# Altium project PV Refridgerator.PrjPCB (part 2 of 3)

## Sheet 15VDC 500mA Boost SMPS.SchDoc: 15VDC Boost SMPS
size A4; Date: 2017-07-12; Revision: A; DesignedBy: Craig Comberbach
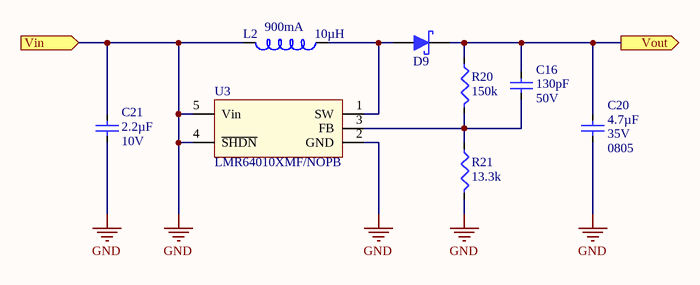
[diagram p8: 15VDC 500mA Boost SMPS.SchDoc]

### Parts
(Parts that share a designator on the sheet are numbered #1, #2 ... from top to bottom, then left to right.)
C16#1  Voltage - Rated: 50V  Capacitance: 130pF  (hidden comment: 130pF 0603 50V)
C20  Voltage - Rated: 35V  Package / Case: 0805  Capacitance: 4.7µF
C21  Capacitance: 2.2µF  Voltage - Rated: 10V  (hidden comment: 2.2uF 0603 10V)
D9  Schottky Diode 60V 3A  [SMA - Diode]  (value not drawn)
L2  Inductance: 10µH  Current - Saturation: 900mA  (hidden comment: 10uH 1210 900mA)
R20#1  Resistance (Ohms): 150k  [R0603]  (hidden comment: 150k 0603 1%)
R21  Resistance (Ohms): 13.3k  [R0603]  (hidden comment: 13.3k 0603 1%)
U3  Manufacturer Part Number: LMR64010XMF/NOPB

### Ports
Vin (in), Vout (out)

### Nets
15VDC: C16#1.2 C20.1 D9.2 R20#1.2 ; port Vout
GND: C20.2 C21.1 C21.2 L2.2 R21.1 U3.2(GND) U3.4(~{SHDN}) U3.5(Vin) ; port Vin
NetC16#1_1: C16#1.1 R20#1.1 R21.2 U3.3(FB)
NetD9_1: D9.1 L2.1 U3.1(SW)

### Notes on the sheet
- Cct
- Designed by
- Rev
- Date
- Sheet       of

### Library data of the parts
C16#1 = 130pF 0603 50V: Non-polarized; Manufacturer: Samsung Electro-Mechanics America, Inc.; Manufacturer Part Number: CL10C131JB8NNNC; Tolerance: ±5%; Temperature Coefficient: C0G, NP0; RoHS: RoHS Compliant; Category: Capacitors; Mounting Type: Surface Mount, MLCC; Operating Temperature: -55°C ~ 125°C; Applications: General Purpose; Ratings: -; Package / Case: 0603 (1608 Metric); Size / Dimension: 0.063" L x 0.031" W (1.60mm x 0.80mm); Height - Seated (Max): -; Thickness (Max): 0.035" (0.90mm); Lead Spacing: -; Features: -; Lead Style: -; ComponentLink1URL: http://media.digikey.com/pdf/Data%20Sheets/Samsung%20PDFs/CL_Series_MLCC_ds.pdf; ComponentLink1Description: Spec Sheet; Value: 130pF 0603 50V; Supplier 1: Digi-Key; Stock 1: 72882; Pricing 1: 1=0.1, 10=0.056, 100=0.0251, 500=0.0179, 1000=0.01407 (USD); Packaging: Cut Tape (CT); Supplier Part Number 1: 1276-2186-1-ND; Part Status: Active
C20 = 4.7uF 0805 35V: Non-polarized; Manufacturer: Samsung Electro-Mechanics America, Inc.; Manufacturer Part Number: CL21A475KLCLQNC; Tolerance: ±10%; Temperature Coefficient: X5R; Value: 4.7uF 0805 35V; Supplier 1: Digi-Key; Supplier Part Number 1: 1276-6722-1-ND; RoHS: RoHS Compliant; Category: Capacitors; Stock 1: 145582; Pricing 1: 1=0.17, 10=0.119, 100=0.0561, 500=0.03932, 1000=0.03255 (USD); Packaging: Cut Tape (CT); Mounting Type: Surface Mount, MLCC; Operating Temperature: -55°C ~ 85°C; Applications: General Purpose; Ratings: -; Size / Dimension: 0.079" L x 0.049" W (2.00mm x 1.25mm); Height - Seated (Max): -; Thickness (Max): 0.037" (0.95mm); Lead Spacing: -; Features: Low Profile; Lead Style: -; ComponentLink1URL: http://www.samsungsem.com/kr/support/library/product-catalog/mlcc.jsp; ComponentLink1Description: Spec Sheet; Part Status: Active
C21 = 2.2uF 0603 10V: Polarized; Manufacturer: Taiyo Yuden; Manufacturer Part Number: LMK107B7225KA-T; Tolerance: ±10%; Temperature Coefficient: X7R; Value: 2.2uF 0603 10V; ComponentLink1URL: http://media.digikey.com/pdf/Data%20Sheets/Taiyo%20Yuden%20PDFs%20URL%20links/LMK107B7225KA-T.pdf; ComponentLink1Description: Spec Sheet; Supplier 1: Digi-Key; Supplier Part Number 1: 587-2983-1-ND; RoHS: RoHS Compliant; Packaging: Cut Tape (CT); Operating Temperature: -55°C ~ 125°C; Mounting Type: Surface Mount, MLCC; Package / Case: 0603 (1608 Metric); Size / Dimension: 0.063" L x 0.031" W (1.60mm x 0.80mm); Height - Seated (Max): -; Lead Spacing: -; Features: -; Category: Capacitors; Stock 1: 348987; Pricing 1: 1=0.19, 10=0.135, 100=0.0633, 500=0.04438, 1000=0.03675 (USD); Part Status: Active; Ratings: -; Applications: General Purpose; Thickness (Max): 0.035" (0.90mm); Lead Style: -
D9 = Schottky Diode 60V 3A: Schottky Diode; Manufacturer: Diodes Incorporated; Manufacturer Part Number: B360A-13-F; Voltage - Forward (Vf) (Max) @ If: 700mV @ 3A; Speed: Fast Recovery =< 500ns, > 200mA (Io); Current - Reverse Leakage @ Vr: 500µA @ 60V; Capacitance @ Vr, F: 200pF @ 4V, 1MHz; Price P/N: 020107-024; Technology: SMT; Value: Schottky Diode 60V 3A; Supplier 1: Digi-Key; Supplier Part Number 1: B360A-FDICT-ND; RoHS: RoHS Compliant; Category: Discrete Semiconductor Products; Stock 1: 36234; Pricing 1: 1=0.63, 10=0.51, 25=0.4468, 100=0.3828, 250=0.3306, 500=0.2842, 1000=0.21609, 2500=0.19903 (CAD); Packaging: Cut Tape (CT); Diode Type: Schottky; Voltage - DC Reverse (Vr) (Max): 60V; Current - Average Rectified (Io): 3A; Reverse Recovery Time (trr): -; Mounting Type: Surface Mount; Package / Case: DO-214AC, SMA; Supplier Device Package: SMA; Operating Temperature - Junction: -55°C ~ 150°C; ComponentLink1URL: http://www.diodes.com/datasheets/ds30891.pdf; ComponentLink1Description: Spec Sheet
L2 = 10uH 1210 900mA: Inductor; Manufacturer: Taiyo Yuden; Manufacturer Part Number: CBC3225T100KR; Type: Wirewound; Material - Core: Ferrite; Tolerance: ±10%; Shielding: Unshielded; DC Resistance (DCR): 172.9 mOhm Max; Frequency - Self Resonant: 23MHz; Value: 10uH 1210 900mA; Supplier 1: Digi-Key; Supplier Part Number 1: 587-3064-1-ND; RoHS: RoHS Compliant; Stock 1: 25536; Pricing 1: 1=0.27, 10=0.237, 25=0.2076, 50=0.178, 100=0.1632, 250=0.1484, 500=0.1395 (USD); Packaging: Cut Tape (CT); Current Rating: 900mA; Q @ Freq: -; Ratings: -; Operating Temperature: -40°C ~ 105°C; Mounting Type: Surface Mount; Package / Case: 1210; Size / Dimension: 0.126" L x 0.098" W (3.20mm x 2.50mm); Height - Seated (Max): 0.106" (2.70mm); ComponentLink1URL: http://ds.yuden.co.jp/TYCOMPAS/ut/detail.do?productNo=CBC3225T100KR&fileName=CBC3225T100KR_SS&mode=specSheetDownload; ComponentLink1Description: Spec Sheet; Category: Inductors, Coils, Chokes; Part Status: Active; Supplier Device Package: 1210
R20#1 = 150k 0603 1%: Manufacturer: Yageo; Manufacturer Part Number: RC0603FR-07150KL; Power (Watts): 0.1W, 1/10W; Temperature Coefficient: ±100ppm/°C; Value: 150k 0603 1%; Supplier 1: Digi-Key; Supplier Part Number 1: 311-150KHRCT-ND; RoHS: RoHS Compliant; Category: Resistors; Stock 1: 705809; Pricing 1: 1=0.1, 10=0.015, 100=0.006, 1000=0.00268, 2500=0.00233 (USD); Packaging: Cut Tape (CT); Tolerance: ±1%; Composition: Thick Film; Features: Moisture Resistant; Package / Case: 0603 (1608 Metric); Supplier Device Package: 0603; Size / Dimension: 0.063" L x 0.031" W (1.60mm x 0.80mm); ComponentLink1URL: http://www.yageo.com/documents/recent/PYu-RC_Group_51_RoHS_L_7.pdf; ComponentLink1Description: Spec Sheet; Part Status: Active; Operating Temperature: -55°C ~ 155°C; Height - Seated (Max): 0.022" (0.55mm); Failure Rate: -
R21 = 13.3k 0603 1%: Manufacturer: Yageo; Manufacturer Part Number: RC0603FR-0713K3L; Power (Watts): 0.1W, 1/10W; Temperature Coefficient: ±100ppm/°C; Value: 13.3k 0603 1%; Supplier 1: Digi-Key; RoHS: RoHS Compliant; Category: Resistors; Stock 1: 289877; Pricing 1: 1=0.1, 10=0.015, 100=0.006, 1000=0.00268, 2500=0.00233 (USD); Packaging: Cut Tape (CT); Tolerance: ±1%; Composition: Thick Film; Features: Moisture Resistant; Operating Temperature: -55°C ~ 155°C; Package / Case: 0603 (1608 Metric); Supplier Device Package: 0603; Size / Dimension: 0.063" L x 0.031" W (1.60mm x 0.80mm); ComponentLink1URL: http://www.yageo.com/documents/recent/PYu-RC_Group_51_RoHS_L_7.pdf; ComponentLink1Description: Spec Sheet; Supplier Part Number 1: 311-13.3KHRCT-ND; Part Status: Active; Height - Seated (Max): 0.022" (0.55mm); Failure Rate: -
U3 = SMPS Boost SOT23-5 LMR64010XMF/NOPB 2.7-14Vin 3-40Vout 1A 1.6MHz: LMR64010XMFE/NOPB; Manufacturer: Texas Instruments; Function: Step-Up; Output Configuration: Positive; Topology: Boost; Output Type: Adjustable; Number of Outputs: 1; Voltage - Input (Min): 2.7V; Voltage - Input (Max): 14V; Voltage - Output (Min/Fixed): 3V; Voltage - Output (Max): 40V (Switch); Current - Output: 1A (Switch); Frequency - Switching: 1.6MHz; Synchronous Rectifier: No; Value: SMPS Boost SOT23-5 LMR64010XMF/NOPB 2.7-14Vin 3-40Vout 1A 1.6MHz; Supplier 1: Digi-Key; Supplier Part Number 1: 296-38770-1-ND; RoHS: RoHS Compliant; Stock 1: 4980; Pricing 1: 1=2.46, 10=2.212, 100=1.7778, 500=1.46062 (CAD); Packaging: Cut Tape (CT); Operating Temperature: -40°C ~ 125°C (TJ); Mounting Type: Surface Mount; Package / Case: SC-74A, SOT-753; Supplier Device Package: SOT-23-5; ComponentLink1URL: http://www.ti.com/lit/ds/symlink/lmr64010.pdf; ComponentLink1Description: Spec Sheet; Category: Integrated Circuits (ICs); Part Status: Active

## Sheet 3.3VDC 250mA Linear PS.SchDoc: 3.3V 250mA Linear Power Supply
size Letter; Date: 2017-07-12; Revision: A; DesignedBy: Craig Comberbach
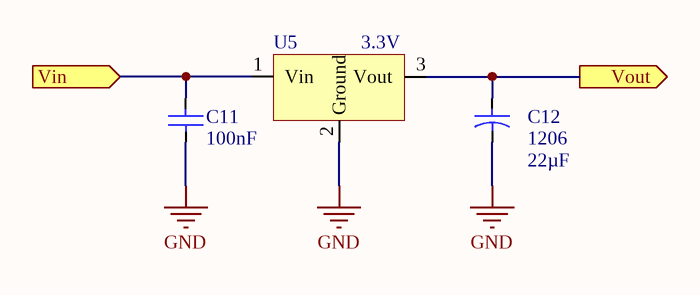
[diagram p9: 3.3VDC 250mA Linear PS.SchDoc]

### Parts
C11  Capacitance: 100nF  [Capacitor - 0603 Ceramic]  (hidden comment: 100nF 0603 50V)
C12  1206  Capacitance: 22µF  [Capacitor - 1210 Tantalum]
U5  Voltage - Output: 3.3V  [SOT223]  (hidden comment: 3.3V Linear Voltage Regulator LDO)

### Ports
Vin (in), Vout (out)

### Nets
3.3VDC: C12.1 U5.3(Vout) ; port Vout
GND: C11.1 C11.2 C12.2 U5.1(Vin) U5.2(Ground) ; port Vin

### Notes on the sheet
- PCB design/layout notes & considerations
- Design notes
- Design Capabilities
- Cct
- Designed by
- Rev
- Date
- Sheet
- of

### Library data of the parts
C11 = 100nF 0603 50V: Non-polarized; Manufacturer: Murata Electronics North America; Manufacturer Part Number: GRM188R71H104KA93D; Value: 100 nF 50V 0603 XR7 10%; Tolerance: ±10%; Temperature Coefficient: X7R; Technology: SMT; Supplier 1: Digi-Key; Supplier Part Number 1: 490-1519-1-ND; RoHS: RoHS Compliant; Category: Capacitors; Stock 1: 4132110; Pricing 1: 1=0.12, 10=0.048, 50=0.0256, 100=0.0218, 250=0.01776, 500=0.0152, 1000=0.01185 (CAD); Packaging: Cut Tape (CT); Voltage - Rated: 50V; Mounting Type: Surface Mount, MLCC; Operating Temperature: -55°C ~ 125°C; Applications: General Purpose; Ratings: -; Package / Case: 0603 (1608 Metric); Size / Dimension: 0.063" L x 0.031" W (1.60mm x 0.80mm); Height - Seated (Max): -; Thickness (Max): 0.035" (0.90mm); Lead Spacing: -; Features: -; Lead Style: -; ComponentLink1URL: http://www.murata.com/products/catalog/pdf/c02e.pdf; ComponentLink1Description: Spec Sheet
C12 = 22uF 1210 10V - Tantalum: Polarized; Manufacturer: AVX Corporation; Manufacturer Part Number: TAJB226K010RNJ; Manufacturer Size Code: B; Value: 22 uF 10V 1210 Tantalum; Tolerance: ±10%; Voltage - Rated: 10V; ESR (Equivalent Series Resistance): 2.4 Ohm; Type: Molded; Technology: SMT; Supplier 1: Digi-Key; Supplier Part Number 1: 478-3039-1-ND; RoHS: RoHS Compliant; Category: Capacitors; Stock 1: 9403; Pricing 1: 1=0.92, 10=0.882, 100=0.428, 250=0.35556, 500=0.32264, 1000=0.29629 (CAD); Packaging: Cut Tape (CT); Operating Temperature: -55°C ~ 125°C; Mounting Type: Surface Mount; Package / Case: 1210 (3528 Metric); Size / Dimension: 0.138" L x 0.110" W (3.50mm x 2.80mm); Height - Seated (Max): 0.083" (2.10mm); Lead Spacing: -; Features: General Purpose; Lifetime @ Temp.: -; ComponentLink1URL: http://www.avx.com/docs/Catalogs/taj.pdf; ComponentLink1Description: Spec Sheet
U5 = 3.3V Linear Voltage Regulator LDO: 500mA; Manufacturer: Micrel Inc; Manufacturer Part Number: MIC5209-3.3YS TR; Regulator Topology: Positive Fixed; Voltage - Dropout (Typical): 0.35V @ 500mA; Number of Regulators: 1; Voltage - Input: Up to 16V; Technology: SMT; Value: 3.3V Linear Voltage Regulator LDO; Supplier 1: Digi-Key; Supplier Part Number 1: 576-1274-1-ND; RoHS: RoHS Compliant; Category: Integrated Circuits (ICs); Stock 1: 13773; Pricing 1: 1=2.1, 10=1.871, 25=1.6516, 100=1.4864, 250=1.29364, 500=1.15602, 1000=0.9083 (CAD); Packaging: Cut Tape (CT); Current - Output: 500mA; Current - Limit (Min): -; Operating Temperature: -40°C ~ 125°C; Mounting Type: Surface Mount; Package / Case: TO-261-4, TO-261AA; Supplier Device Package: SOT-223; ComponentLink1URL: http://www.micrel.com/_PDF/mic5209.pdf; ComponentLink1Description: Spec Sheet

## Sheet 5VDC 250mA Buck SMPS.SchDoc: 5VDC 250mA Switching Regulator
size A4; Date: 2017-07-12; DocumentNumber: 3; Revision: A; SheetNumber: 3; SheetTotal: 12; DesignedBy: Craig Comberbach
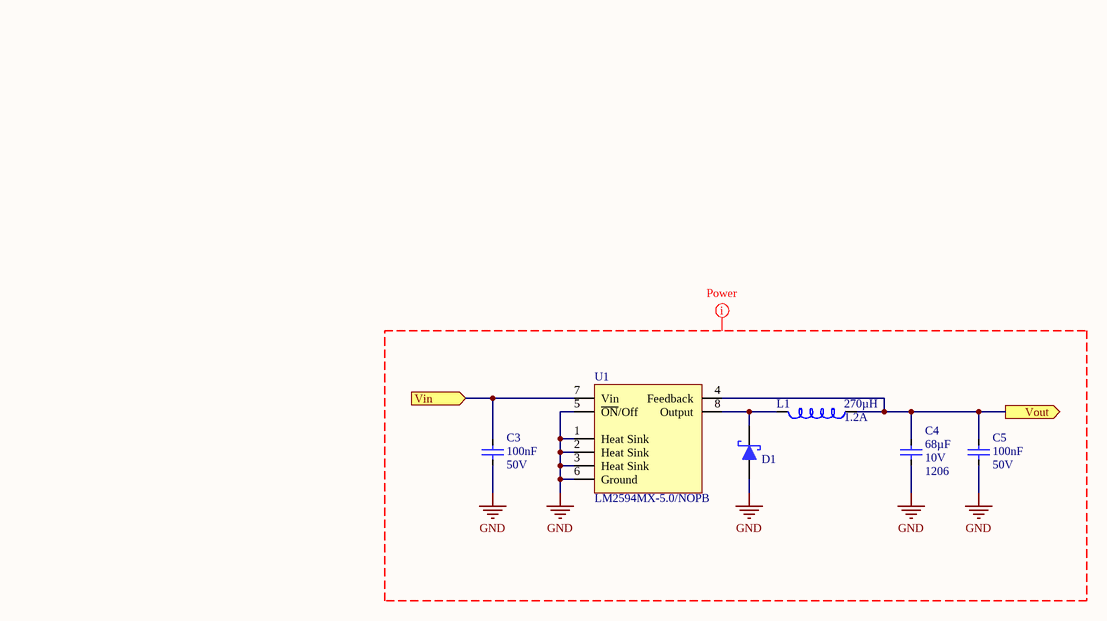
[diagram p10: 5VDC 250mA Buck SMPS.SchDoc]

### Parts
(Parts that share a designator on the sheet are numbered #1, #2 ... from top to bottom, then left to right.)
C3  Voltage - Rated: 50V  Capacitance: 100nF  [Capacitor - 0603 Ceramic]  (hidden comment: 100nF 0603 50V)
C4#1  Voltage - Rated: 10V  Package / Case: 1206  Capacitance: 68µF  (hidden comment: 68uF 1206 10V)
C5#1  Voltage - Rated: 50V  Capacitance: 100nF  [Capacitor - 0603 Ceramic]  (hidden comment: 100nF 0603 50V)
D1#2  Schottky Diode 60V 3A  [SMA - Diode]  (value not drawn)
L1  Inductance: 270µH  Current - Saturation: 1.2A  (hidden comment: 270uH SRR1260 1.2A)
U1#1  Manufacturer Part Number: LM2594MX-5.0/NOPB  (hidden comment: 5VDC 250mA SMPS)

### Ports
Vin (in), Vout (out)

### Nets
GND: C3.2 C4#1.1 C4#1.2 C5#1.1 C5#1.2 D1#2.1 L1.1 U1#1.1(Heat_Sink) U1#1.2(Heat_Sink) U1#1.3(Heat_Sink) U1#1.4(Feedback) U1#1.5(~{ON}/Off) U1#1.6(Ground) ; port Vout
+Vsolar: C3.1 U1#1.7(Vin) ; port Vin
NetD1#2_2: D1#2.2 L1.2 U1#1.8(Output)

### Layout directives
net class Power: GND

### Notes on the sheet
- Change Log:
  Rev A	2014-11-19	Craig Comberbach
  Initial Design
  Rev B	2017-01-27	Craig Comberbach
  Added inline nettie for current sensing
  Removed 5.5V MOV from the output
  Added current sensing test clips as well as a ground test clip
- Cct
- Designed by
- Rev
- Date
- Sheet       of

### Library data of the parts
C3 C5#1 = 100nF 0603 50V: as C11 on sheet 3.3VDC 250mA Linear PS; Price P/N: 020101-017; Technology: SMT; Supplier 1: Digi-Key; Supplier Part Number 1: 490-1519-1-ND; RoHS: RoHS Compliant; Category: Capacitors; Stock 1: 4132110; Pricing 1: 1=0.12, 10=0.048, 50=0.0256, 100=0.0218, 250=0.01776, 500=0.0152, 1000=0.01185 (CAD); Packaging: Cut Tape (CT); Mounting Type: Surface Mount, MLCC; Operating Temperature: -55°C ~ 125°C; Applications: General Purpose; Ratings: -; Package / Case: 0603 (1608 Metric); Size / Dimension: 0.063" L x 0.031" W (1.60mm x 0.80mm); Height - Seated (Max): -; Thickness (Max): 0.035" (0.90mm); Lead Spacing: -; Features: -; Lead Style: -; ComponentLink1URL: http://www.murata.com/products/catalog/pdf/c02e.pdf; ComponentLink1Description: Spec Sheet
C4#1 = 68uF 1206 10V: Non-polarized; Manufacturer: TDK Corporation; Manufacturer Part Number: C3216X5R1A686M160AC; Tolerance: ±20%; Temperature Coefficient: X5R; Value: 68uF 1206 10V; Supplier 1: Digi-Key; Supplier Part Number 1: 445-14673-1-ND; RoHS: RoHS Compliant; Category: Capacitors; Stock 1: 17695; Pricing 1: 1=1.59, 10=1.252, 100=0.9393, 500=0.70966, 1000=0.62618 (USD); Packaging: Cut Tape (CT); Operating Temperature: -55°C ~ 85°C; Mounting Type: Surface Mount, MLCC; Size / Dimension: 0.126" L x 0.063" W (3.20mm x 1.60mm); Height - Seated (Max): -; Lead Spacing: -; Features: Low ESL; ComponentLink1URL: https://product.tdk.com/info/en/catalog/datasheets/mlcc_commercial_general_en.pdf; ComponentLink1Description: Spec Sheet; Part Status: Active; Ratings: -; Applications: General Purpose; Failure Rate: -; Thickness (Max): 0.071" (1.80mm); Lead Style: -
D1#2 = Schottky Diode 60V 3A: as D9 on sheet 15VDC 500mA Boost SMPS; Price P/N: 020107-024; Technology: SMT; Value: Schottky Diode 60V 3A; Supplier 1: Digi-Key; Supplier Part Number 1: B360A-FDICT-ND; RoHS: RoHS Compliant; Category: Discrete Semiconductor Products; Stock 1: 36234; Pricing 1: 1=0.63, 10=0.51, 25=0.4468, 100=0.3828, 250=0.3306, 500=0.2842, 1000=0.21609, 2500=0.19903 (CAD); Packaging: Cut Tape (CT); Diode Type: Schottky; Voltage - DC Reverse (Vr) (Max): 60V; Current - Average Rectified (Io): 3A; Reverse Recovery Time (trr): -; Mounting Type: Surface Mount; Package / Case: DO-214AC, SMA; Supplier Device Package: SMA; Operating Temperature - Junction: -55°C ~ 150°C; ComponentLink1URL: http://www.diodes.com/datasheets/ds30891.pdf; ComponentLink1Description: Spec Sheet
L1 = 270uH SRR1260 1.2A: Inductor; Manufacturer: Bourns Inc.; Manufacturer Part Number: SRR1260-271K; Shielding: Shielded; Tolerance: ±10%; Type: Wirewound; Material - Core: Ferrite; Current Rating: 1.3A; DC Resistance (DCR): 450 mOhm Max; Q @ Freq: 20 @ 796kHz; Frequency - Self Resonant: 3.6MHz; Value: 270uH SRR1260 1.2A; Supplier 1: Digi-Key; Supplier Part Number 1: SRR1260-271KCT-ND; RoHS: RoHS Compliant; Category: Inductors, Coils, Chokes; Stock 1: 13499; Packaging: Cut Tape (CT); ComponentLink1URL: http://www.bourns.com/docs/Product-Datasheets/SRR1260.pdf; ComponentLink1Description: Spec Sheet; Pricing 1: 1=1, 10=0.927, 100=0.6702 (USD); Part Status: Active; Ratings: -; Operating Temperature: -40°C ~ 125°C; Mounting Type: Surface Mount; Package / Case: Nonstandard; Supplier Device Package: -; Size / Dimension: 0.492" L x 0.492" W (12.50mm x 12.50mm); Height - Seated (Max): 0.256" (6.50mm)
U1#1 = 5VDC 250mA SMPS: Manufacturer: Texas Instruments; Output Type: Fixed; Number of Outputs: 1; Frequency - Switching: 150kHz; Current - Output: 500mA; Synchronous Rectifier: No; Function: Step-Down; Output Configuration: Positive; Topology: Buck; Voltage - Input (Min): 4.5V; Voltage - Input (Max): 40V; Voltage - Output (Min/Fixed): 5V; Supplier 1: Digi-Key; Supplier Part Number 1: LM2594MX-5.0/NOPBCT-ND; RoHS: RoHS Compliant; Category: Integrated Circuits (ICs); Stock 1: 3233; Pricing 1: 1=3.28, 10=2.942, 100=2.4102, 500=2.05176, 1000=1.7304 (USD); Packaging: Cut Tape (CT); Operating Temperature: -40°C ~ 125°C (TJ); Mounting Type: Surface Mount; Package / Case: 8-SOIC (0.154", 3.90mm Width); Supplier Device Package: 8-SOIC; ComponentLink1URL: http://www.ti.com/lit/ds/symlink/lm2594.pdf; ComponentLink1Description: Spec Sheet; Value: 5VDC 250mA SMPS; Part Status: Active; Voltage - Output (Max): -

## Sheet Microcontroller.SchDoc: Microcontroller
size Letter; Date: 2017-07-12; DocumentNumber: 10; Revision: B; SheetNumber: 10; SheetTotal: 16; DesignedBy: Craig Comberbach
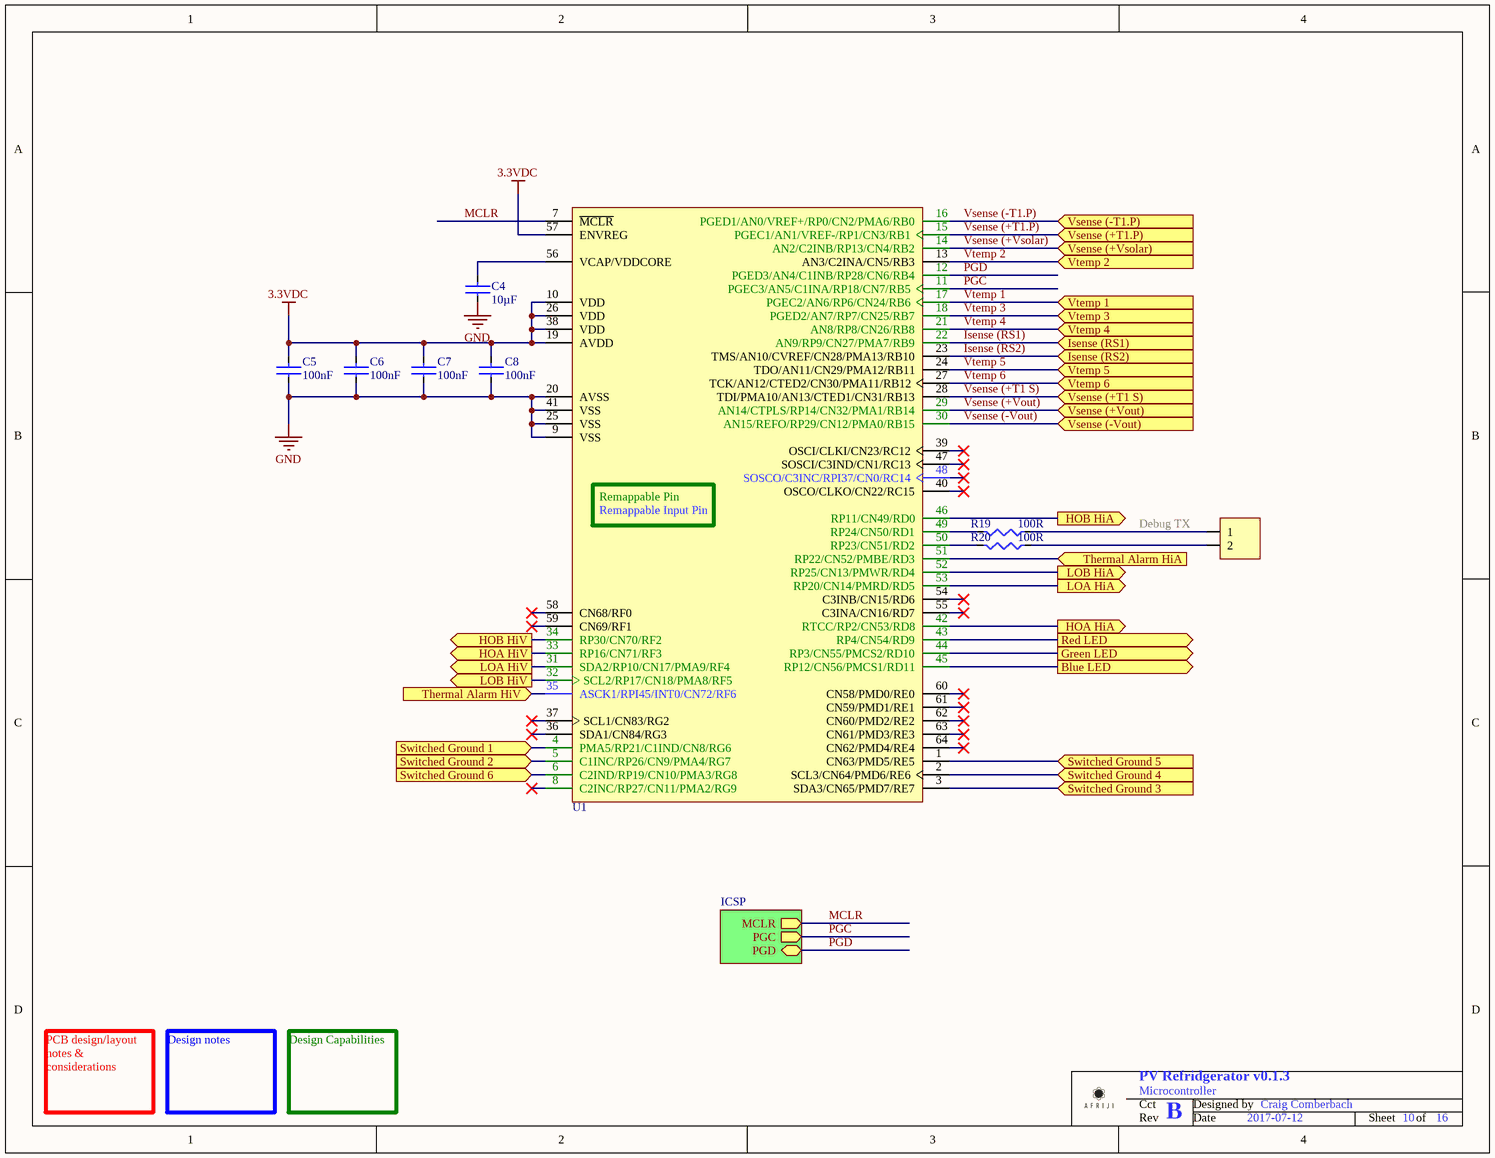
[diagram p11: Microcontroller.SchDoc]

### Parts
(Parts that share a designator on the sheet are numbered #1, #2 ... from top to bottom, then left to right.)
C4#2  Capacitance: 10µF  [C0805 - Ceramic]  (hidden comment: 10uF 0805 10V)
C5#2  Capacitance: 100nF  [C0603 - Ceramic]  (hidden comment: 100nF 0603 50V)
C6  Capacitance: 100nF  [C0603 - Ceramic]  (hidden comment: 100nF 0603 50V)
C7  Capacitance: 100nF  [C0603 - Ceramic]  (hidden comment: 100nF 0603 50V)
C8  Capacitance: 100nF  [C0603 - Ceramic]  (hidden comment: 100nF 0603 50V)
R19  Resistance (Ohms): 100R  [R0603]  (hidden comment: 100R 0603 1%)
R20#2  Resistance (Ohms): 100R  [R0603]  (hidden comment: 100R 0603 1%)
TP3  MTA100-2 with friction Lock  (value not drawn)
U1#2  PIC24FJ256GA106 Microprocessor  [TQFP - 64]  (value not drawn)

### Sub-sheets
ICSP = ICSP.SchDoc: MCLR (out), PGD (bidir), PGC (out)

### Ports
Blue LED (out), Green LED (out), HOA HiA (out), HOA HiV (out), HOB HiA (out), HOB HiV (out), Isense (RS1) (in), Isense (RS2) (in), LOA HiA (out), LOA HiV (out), LOB HiA (out), LOB HiV (out), Red LED (out), Switched Ground 1 (in), Switched Ground 2 (in), Switched Ground 3 (in), Switched Ground 4 (in), Switched Ground 5 (in), Switched Ground 6 (in), Thermal Alarm HiA (in), Thermal Alarm HiV (in), Vsense (+T1 S) (in), Vsense (+T1.P) (in), Vsense (+Vout) (in), Vsense (+Vsolar) (in), Vsense (-T1.P) (in), Vsense (-Vout) (in), Vtemp 1 (in), Vtemp 2 (in), Vtemp 3 (in), Vtemp 4 (in), Vtemp 5 (in), Vtemp 6 (in)

### Nets
3.3VDC: C5#2.1 C6.1 C7.1 C8.1 U1#2.10(VDD) U1#2.19(AVDD) U1#2.26(VDD) U1#2.38(VDD) U1#2.57(ENVREG)
GND: C4#2.2 C5#2.2 C6.2 C7.2 C8.2 U1#2.9(VSS) U1#2.20(AVSS) U1#2.25(VSS) U1#2.41(VSS)
Debug TX: R19.2 TP3.1
Isense (RS1): U1#2.22(AN9/RP9/CN27/PMA7/RB9) ; port Isense (RS1)
Isense (RS2): U1#2.23(TMS/AN10/CVREF/CN28/PMA13/RB10) ; port Isense (RS2)
MCLR: U1#2.7(~{MCLR}) ; sheet ICSP/MCLR
PGC: U1#2.11(PGEC3/AN5/C1INA/RP18/CN7/RB5) ; sheet ICSP/PGC
PGD: U1#2.12(PGED3/AN4/C1INB/RP28/CN6/RB4) ; sheet ICSP/PGD
Switched Ground 1: U1#2.4(PMA5/RP21/C1IND/CN8/RG6) ; port Switched Ground 1
Switched Ground 2: U1#2.5(C1INC/RP26/CN9/PMA4/RG7) ; port Switched Ground 2
Switched Ground 3: U1#2.3(SDA3/CN65/PMD7/RE7) ; port Switched Ground 3
Switched Ground 4: U1#2.2(SCL3/CN64/PMD6/RE6) ; port Switched Ground 4
Switched Ground 5: U1#2.1(CN63/PMD5/RE5) ; port Switched Ground 5
Switched Ground 6: U1#2.6(C2IND/RP19/CN10/PMA3/RG8) ; port Switched Ground 6
Vsense (+T1 S): U1#2.28(TDI/PMA10/AN13/CTED1/CN31/RB13) ; port Vsense (+T1 S)
Vsense (+T1.P): U1#2.15(PGEC1/AN1/VREF-/RP1/CN3/RB1) ; port Vsense (+T1.P)
Vsense (+Vout): U1#2.29(AN14/CTPLS/RP14/CN32/PMA1/RB14) ; port Vsense (+Vout)
Vsense (+Vsolar): U1#2.14(AN2/C2INB/RP13/CN4/RB2) ; port Vsense (+Vsolar)
Vsense (-T1.P): U1#2.16(PGED1/AN0/VREF+/RP0/CN2/PMA6/RB0) ; port Vsense (-T1.P)
Vsense (-Vout): U1#2.30(AN15/REFO/RP29/CN12/PMA0/RB15) ; port Vsense (-Vout)
Vtemp 1: U1#2.17(PGEC2/AN6/RP6/CN24/RB6) ; port Vtemp 1
Vtemp 2: U1#2.13(AN3/C2INA/CN5/RB3) ; port Vtemp 2
Vtemp 3: U1#2.18(PGED2/AN7/RP7/CN25/RB7) ; port Vtemp 3
Vtemp 4: U1#2.21(AN8/RP8/CN26/RB8) ; port Vtemp 4
Vtemp 5: U1#2.24(TDO/AN11/CN29/PMA12/RB11) ; port Vtemp 5
Vtemp 6: U1#2.27(TCK/AN12/CTED2/CN30/PMA11/RB12) ; port Vtemp 6
NetC4#2_1: C4#2.1 U1#2.56(VCAP/VDDCORE)
NetR19_1: R19.1 U1#2.49(RP24/CN50/RD1)
NetR20#2_1: R20#2.1 U1#2.50(RP23/CN51/RD2)
NetR20#2_2: R20#2.2 TP3.2
NetU1#2_31: U1#2.31(SDA2/RP10/CN17/PMA9/RF4) ; port LOA HiV
NetU1#2_32: U1#2.32(SCL2/RP17/CN18/PMA8/RF5) ; port LOB HiV
NetU1#2_33: U1#2.33(RP16/CN71/RF3) ; port HOA HiV
NetU1#2_34: U1#2.34(RP30/CN70/RF2) ; port HOB HiV
NetU1#2_35: U1#2.35(ASCK1/RPI45/INT0/CN72/RF6) ; port Thermal Alarm HiV
NetU1#2_42: U1#2.42(RTCC/RP2/CN53/RD8) ; port HOA HiA
NetU1#2_43: U1#2.43(RP4/CN54/RD9) ; port Red LED
NetU1#2_44: U1#2.44(RP3/CN55/PMCS2/RD10) ; port Green LED
NetU1#2_45: U1#2.45(RP12/CN56/PMCS1/RD11) ; port Blue LED
NetU1#2_46: U1#2.46(RP11/CN49/RD0) ; port HOB HiA
NetU1#2_51: U1#2.51(RP22/CN52/PMBE/RD3) ; port Thermal Alarm HiA
NetU1#2_52: U1#2.52(RP25/CN13/PMWR/RD4) ; port LOB HiA
NetU1#2_53: U1#2.53(RP20/CN14/PMRD/RD5) ; port LOA HiA

Not connected (* = marked no-connect by the designer): U1#2 8(C2INC/RP27/CN11/PMA2/RG9)* 36(SDA1/CN84/RG3)* 37(SCL1/CN83/RG2)* 39(OSCI/CLKI/CN23/RC12)* 40(OSCO/CLKO/CN22/RC15)* 47(SOSCI/C3IND/CN1/RC13)* 48(SOSCO/C3INC/RPI37/CN0/RC14)* 54(C3INB/CN15/RD6)* 55(C3INA/CN16/RD7)* 58(CN68/RF0)* 59(CN69/RF1)* 60(CN58/PMD0/RE0)* 61(CN59/PMD1/RE1)* 62(CN60/PMD2/RE2)* 63(CN61/PMD3/RE3)* 64(CN62/PMD4/RE4)*

### Notes on the sheet
- PCB design/layout notes & considerations
- Design notes
- Design Capabilities
- Cct
- Designed by
- Rev
- Date
- Sheet
- of
- (in symbol PIC24FJ256GA106 Microprocessor) Remappable Pin; Remappable Input Pin

### Library data of the parts
C4#2 = 10uF 0805 10V: Manufacturer: Kemet; Manufacturer Part Number: C0805C106K8PACTU; Tolerance: ±10%; Temperature Coefficient: X5R; Value: 10uF 0805 10V; Supplier 1: Digi-Key; RoHS: RoHS Compliant; Category: Capacitors; Stock 1: 215894; Pricing 1: 1=0.21, 10=0.14, 50=0.085, 100=0.0714, 250=0.0578, 500=0.051, 1000=0.04335 (USD); Packaging: Cut Tape (CT); Voltage - Rated: 10V; Mounting Type: Surface Mount, MLCC; Operating Temperature: -55°C ~ 85°C; Applications: General Purpose; Ratings: -; Package / Case: 0805 (2012 Metric); Size / Dimension: 0.079" L x 0.049" W (2.00mm x 1.25mm); Height - Seated (Max): -; Thickness (Max): 0.055" (1.40mm); Lead Spacing: -; Features: -; Lead Style: -; ComponentLink1URL: http://www.kemet.com/docfinder?Partnumber=C0805C106K8PACTU; ComponentLink1Description: Spec Sheet; Supplier Part Number 1: 399-4925-1-ND
C5#2 C6-C8 = 100nF 0603 50V: Manufacturer: Samsung Electro-Mechanics America, Inc; Manufacturer Part Number: CL10B104KB8SFNC; Tolerance: ±10%; Temperature Coefficient: X7R; Value: 100nF 0603 50V; Supplier 1: Digi-Key; RoHS: RoHS Compliant; Category: Capacitors; Stock 1: 1192070; Pricing 1: 1=0.1, 10=0.027, 25=0.0192, 100=0.0125, 500=0.00874, 1000=0.00681 (USD); Packaging: Cut Tape (CT); Voltage - Rated: 50V; Mounting Type: Surface Mount, MLCC; Operating Temperature: -55°C ~ 125°C; Applications: Boardflex Sensitive; Ratings: -; Package / Case: 0603 (1608 Metric); Size / Dimension: 0.063" L x 0.031" W (1.60mm x 0.80mm); Height - Seated (Max): -; Thickness (Max): 0.035" (0.90mm); Lead Spacing: -; Features: Soft Termination; Lead Style: -; ComponentLink1URL: http://www.samsungsem.com/kr/front/downloadcms.do?path=/kr/support/product-search/mlcc/__icsFiles/afieldfile/2014/11/05&fileName=S_CL10B104KB8SFNC.pdf; ComponentLink1Description: Spec Sheet; Supplier Part Number 1: 1276-1936-1-ND
R19 R20#2 = 100R 0603 1%: 1/8W; Manufacturer: Yageo; Manufacturer Part Number: RC0603FR-07100RL; Power (Watts): 0.1W, 1/10W; Temperature Coefficient: ±100ppm/°C; Value: 100R 0603 1%; Supplier 1: Digi-Key; RoHS: RoHS Compliant; Category: Resistors; Stock 1: 2116183; Pricing 1: 1=0.1, 10=0.015, 25=0.0108, 100=0.006, 250=0.00456, 500=0.00364, 1000=0.00268, 2500=0.00233 (USD); Packaging: Cut Tape (CT); Tolerance: ±1%; Composition: Thick Film; Features: Moisture Resistant; Operating Temperature: -55°C ~ 155°C; Package / Case: 0603 (1608 Metric); Supplier Device Package: 0603; Size / Dimension: 0.063" L x 0.031" W (1.60mm x 0.80mm); Height: 0.022" (0.55mm); Number of Terminations: 2; ComponentLink1URL: http://www.yageo.com/NewPortal/yageodocoutput?fileName=/pdf/R-Chip/PYu-RC_Group_51_RoHS_L_0.pdf; ComponentLink1Description: http://www.yageo.com/NewPortal/yageodocoutput?fileName=/pdf/R-Chip/PYu-RC_Group_51_RoHS_L_0.pdf; Supplier Part Number 1: 311-100HRCT-ND
TP3 = MTA100-2 with friction Lock: Manufacturer: TE Connectivity AMP Connectors; Manufacturer Part Number: 640456-2; Connector Type: Header; Pitch - Mating: 0.100" (2.54mm); Style: Board to Cable/Wire; Shrouding: Shrouded - 1 Wall; Number of Positions: 2; Number of Positions Loaded: All; Contact Length - Mating: 0.295" (7.49mm); Contact Length - Post: 0.140" (3.56mm); Overall Contact Length: 0.535" (13.59mm); Material Flammability Rating: UL94 V-0; Current Rating: Varies by Wire Gauge; Voltage Rating: 250VAC; Value: MTA100-2 with friction Lock; Supplier 1: Digi-Key; RoHS: RoHS Compliant; Category: Connectors, Interconnects; Stock 1: 177276; Pricing 1: 1=0.12, 10=0.117, 50=0.0748, 100=0.0724, 250=0.0624, 500=0.05992, 1000=0.05243, 2500=0.04744 (USD); Packaging: Bulk; Part Status: Active; Mounting Type: Through Hole; ComponentLink1URL: http://www.te.com/commerce/DocumentDelivery/DDEController?Action=srchrtrv&DocNm=640456&DocType=Customer+Drawing&DocLang=English; ComponentLink1Description: Spec Sheet; Supplier Part Number 1: A1921-ND; Contact Type: Male Pin; Number of Rows: 1; Row Spacing - Mating: -; Termination: Solder; Fastening Type: Friction Lock; Insulation Height: 0.305" (7.75mm); Contact Shape: Square; Contact Finish - Mating: Tin; Contact Finish Thickness - Mating: -; Contact Finish - Post: Tin; Contact Material: Copper Alloy; Insulation Material: Thermoplastic; Features: -; Operating Temperature: -55°C ~ 105°C; Ingress Protection: -; Insulation Color: Natural; Mated Stacking Heights: -; Contact Finish Thickness - Post: -; Applications: General Purpose
U1#2 = PIC24FJ256GA106 Microprocessor: General Purpose 16-Bit Flash Microcontroller, 256KB Flash, 16KB SRAM, 64-Pin TQFP, Industrial Temperature; Manufacturer: Microchip Technology; Manufacturer Part Number: PIC24FJ256GA106-I/PT; Core Processor: PIC; Speed: 32MHz; Connectivity: I²C, PMP, SPI, UART/USART; Peripherals: Brown-out Detect/Reset, LVD, POR, PWM, WDT; Number of I/O: 53; Program Memory Size: 256KB (85.5K x 24); RAM Size: 16K x 8; Voltage - Supply (Vcc/Vdd): 2 V ~ 3.6 V; Data Converters: A/D 16x10b; Oscillator Type: Internal; Value: PIC24FJ256GA106 Microprocessor; Technology: SMT; Supplier 1: Digi-Key; Supplier Part Number 1: PIC24FJ256GA106-I/PT-ND; RoHS: RoHS Compliant; Category: Integrated Circuits (ICs); Stock 1: 6379; Pricing 1: 1=7.45, 10=6.201, 25=5.6864, 100=5.1477 (CAD); Packaging: Tray; Core Size: 16-Bit; Program Memory Type: FLASH; EEPROM Size: -; Operating Temperature: -40°C ~ 85°C; Package / Case: 64-TQFP; Supplier Device Package: 64-TQFP (10x10); ComponentLink1URL: http://www.microchip.com/mymicrochip/filehandler.aspx?ddocname=en534317; ComponentLink1Description: Spec Sheet

## Sheet ICSP.SchDoc: ICSP
size Letter; Date: 2017-02-06; DocumentNumber: 11; Revision: B; SheetNumber: 11; SheetTotal: 16; DesignedBy: Craig Comberbach
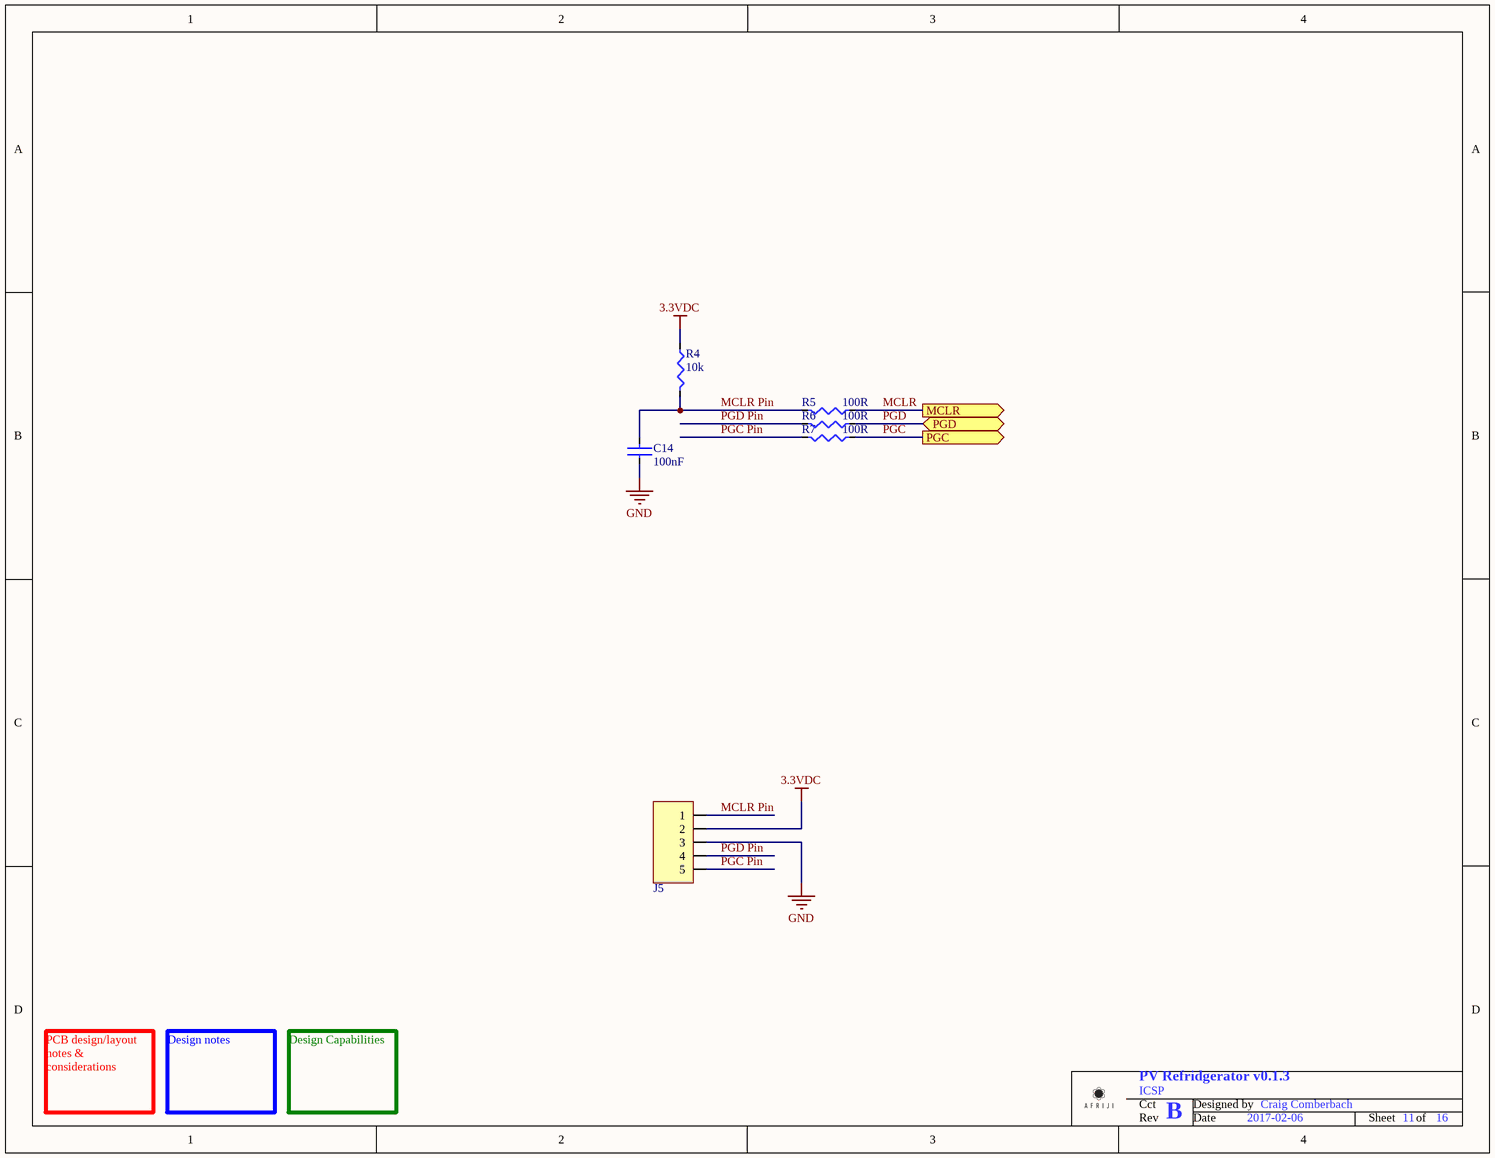
[diagram p12: ICSP.SchDoc]

### Parts
C14  Capacitance: 100nF  [C0603 - Ceramic]  (hidden comment: 100nF 0603 50V)
J5  MTA100 - 5-Pin with friction Lock  [Connector - MTA-100 5 Position]  (value not drawn)
R4  Resistance (Ohms): 10k  [R0603]  (hidden comment: 10k 0603 1%)
R5  Resistance (Ohms): 100R  [R0603]  (hidden comment: 100R 0603 1%)
R6  Resistance (Ohms): 100R  [R0603]  (hidden comment: 100R 0603 1%)
R7  Resistance (Ohms): 100R  [R0603]  (hidden comment: 100R 0603 1%)

### Ports
MCLR (out), PGC (out), PGD (bidir)

### Nets
3.3VDC: J5.2 R4.1
GND: C14.2 J5.3
MCLR: R5.2 ; port MCLR
MCLR Pin: C14.1 J5.1 R4.2 R5.1
PGC: R7.2 ; port PGC
PGC Pin: J5.5 R7.1
PGD: R6.2 ; port PGD
PGD Pin: J5.4 R6.1

### Notes on the sheet
- PCB design/layout notes & considerations
- Design notes
- Design Capabilities
- Cct
- Designed by
- Rev
- Date
- Sheet
- of

### Library data of the parts
C14 = 100nF 0603 50V: as C5#2 on sheet Microcontroller; Value: 100nF 0603 50V; Supplier 1: Digi-Key; RoHS: RoHS Compliant; Category: Capacitors; Stock 1: 1192070; Pricing 1: 1=0.1, 10=0.027, 25=0.0192, 100=0.0125, 500=0.00874, 1000=0.00681 (USD); Packaging: Cut Tape (CT); Voltage - Rated: 50V; Mounting Type: Surface Mount, MLCC; Operating Temperature: -55°C ~ 125°C; Applications: Boardflex Sensitive; Ratings: -; Package / Case: 0603 (1608 Metric); Size / Dimension: 0.063" L x 0.031" W (1.60mm x 0.80mm); Height - Seated (Max): -; Thickness (Max): 0.035" (0.90mm); Lead Spacing: -; Features: Soft Termination; Lead Style: -; ComponentLink1URL: http://www.samsungsem.com/kr/front/downloadcms.do?path=/kr/support/product-search/mlcc/__icsFiles/afieldfile/2014/11/05&fileName=S_CL10B104KB8SFNC.pdf; ComponentLink1Description: http://www.samsungsem.com/kr/front/downloadcms.do?path=/kr/support/product-search/mlcc/__icsFiles/afieldfile/2014/11/05&fileName=S_CL10B104KB8SFNC.pdf; Supplier Part Number 1: 1276-1936-1-ND
J5 = MTA100 - 5-Pin with friction Lock: Flash Programmer; Manufacturer: TE Connectivity; Manufacturer Part Number: 640456-5; Connector Type: Header, Unshrouded; Number of Positions: 5; Number of Positions Loaded: All; Pitch: 0.100" (2.54mm); Supplier 1: Digi-Key; Supplier Part Number 1: A19471-ND; RoHS: RoHS Compliant; Category: Connectors, Interconnects; Stock 1: 38829; Pricing 1: 1=0.34, 10=0.314, 50=0.2286, 100=0.2197, 250=0.1972, 500=0.18824, 1000=0.15687, 2500=0.14343, 5000=0.13446 (CAD); Packaging: Bulk; Contact Type: Male Pin; Number of Rows: 1; Row Spacing: -; Contact Mating Length: 0.295" (7.49mm); Mounting Type: Through Hole; Termination: Solder; Fastening Type: Friction Lock; Features: -; Contact Finish: Tin; Contact Finish Thickness: -; Color: Natural; ComponentLink1URL: http://www.te.com/commerce/DocumentDelivery/DDEController?Action=srchrtrv&DocNm=640456&DocType=Customer+Drawing&DocLang=English; ComponentLink1Description: Spec Sheet; Technology: THT; Value: MTA100 - 5-Pin with friction Lock
R4 = 10k 0603 1%: Resistor; Manufacturer: Yageo; Manufacturer Part Number: RC0603FR-0710KL; Power (Watts): 0.1W, 1/10W; Temperature Coefficient: ±100ppm/°C; Value: 10k 0603 1%; Supplier 1: Digi-Key; RoHS: RoHS Compliant; Category: Resistors; Stock 1: 5171799; Pricing 1: 1=0.1, 10=0.015, 25=0.0108, 100=0.006, 250=0.00456, 500=0.00364, 1000=0.00268, 2500=0.00233 (USD); Packaging: Cut Tape (CT); Tolerance: ±1%; Composition: Thick Film; Features: Moisture Resistant; Package / Case: 0603 (1608 Metric); Supplier Device Package: 0603; Size / Dimension: 0.063" L x 0.031" W (1.60mm x 0.80mm); Height: 0.022" (0.55mm); Number of Terminations: 2; ComponentLink1URL: http://www.yageo.com/NewPortal/yageodocoutput?fileName=/pdf/R-Chip/PYu-RC_Group_51_RoHS_L_0.pdf; ComponentLink1Description: http://www.yageo.com/NewPortal/yageodocoutput?fileName=/pdf/R-Chip/PYu-RC_Group_51_RoHS_L_0.pdf; Supplier Part Number 1: 311-10.0KHRCT-ND; Operating Temperature: -55°C ~ 155°C
R5-R7 = 100R 0603 1%: as R19 on sheet Microcontroller; Value: 100R 0603 1%; Supplier 1: Digi-Key; RoHS: RoHS Compliant; Category: Resistors; Stock 1: 2116183; Pricing 1: 1=0.1, 10=0.015, 25=0.0108, 100=0.006, 250=0.00456, 500=0.00364, 1000=0.00268, 2500=0.00233 (USD); Packaging: Cut Tape (CT); Tolerance: ±1%; Composition: Thick Film; Features: Moisture Resistant; Package / Case: 0603 (1608 Metric); Supplier Device Package: 0603; Size / Dimension: 0.063" L x 0.031" W (1.60mm x 0.80mm); Height: 0.022" (0.55mm); Number of Terminations: 2; ComponentLink1URL: http://www.yageo.com/NewPortal/yageodocoutput?fileName=/pdf/R-Chip/PYu-RC_Group_51_RoHS_L_0.pdf; ComponentLink1Description: http://www.yageo.com/NewPortal/yageodocoutput?fileName=/pdf/R-Chip/PYu-RC_Group_51_RoHS_L_0.pdf; Supplier Part Number 1: 311-100HRCT-ND; Operating Temperature: -55°C ~ 155°C

## Sheet Vsense 0-69.3V.SchDoc: Vsense from 0 to 69.3V
size Letter; Date: 2017-07-12; DocumentNumber: 12; Revision: B; SheetNumber: 12; SheetTotal: 16; DesignedBy: Mike MacKay
Used 3 times, as channels Vsense 0-69.3V, Vsense (0-69.3V), Vsense 0-69.3V. Parts and nets are listed once, with the designators drawn on the sheet.
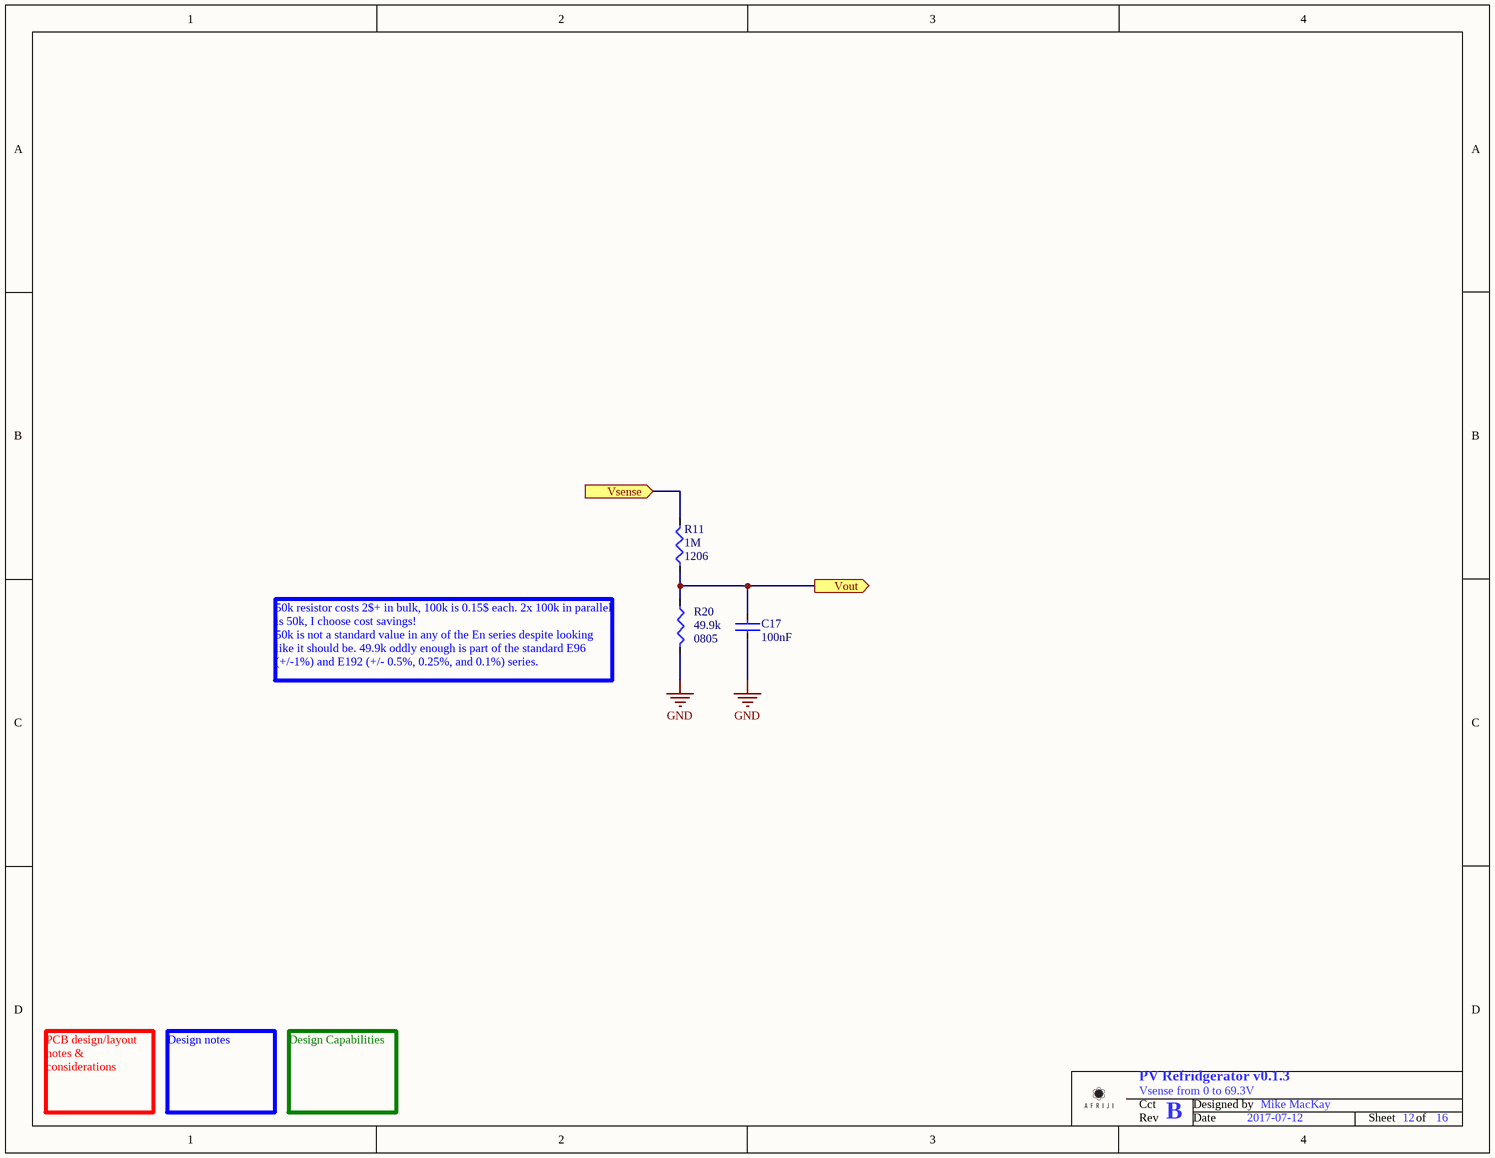
[diagram p13: Vsense 0-69.3V.SchDoc]

### Parts
C17  Capacitance: 100nF  [C0603 - Ceramic]  (hidden comment: 100nF 0603 50V)
R11  Resistance (Ohms): 1M  Supplier Device Package: 1206  [R1210]  (hidden comment: 1M 1206 1%)
R20  Resistance (Ohms): 49.9k  Supplier Device Package: 0805  [R0805]  (hidden comment: Template - Resistor)

### Ports
Vout (out), Vsense (in)

### Nets
GND: C17.2 R20.1
Vout: C17.1 R11.2 R20.2 ; port Vout
Vsense: R11.1 ; port Vsense

### Channels
Vsense 0-69.3V: designators end in A; ports Vout=Vsense (+T1.P) Vsense=NetNetTie8_2
Vsense (0-69.3V): designators end in B; ports Vout=Vsense (+Vsolar) Vsense=NetNetTie7_2
Vsense 0-69.3V: designators end in C; ports Vout=Vsense (-T1.P) Vsense=NetNetTie9_2

### Notes on the sheet
- 50k resistor costs 2$+ in bulk, 100k is 0.15$ each. 2x 100k in parallel is 50k, I choose cost savings!
  50k is not a standard value in any of the En series despite looking like it should be. 49.9k oddly enough is part of the standard E96 (+/-1%) and E192 (+/- 0.5%, 0.25%, and 0.1%) series.
- PCB design/layout notes & considerations
- Design notes
- Design Capabilities
- Cct
- Designed by
- Rev
- Date
- Sheet
- of

### Library data of the parts
C17 = 100nF 0603 50V: as C5#2 on sheet Microcontroller; Value: 100nF 0603 50V; Supplier 1: Digi-Key; RoHS: RoHS Compliant; Category: Capacitors; Stock 1: 1192070; Pricing 1: 1=0.1, 10=0.027, 25=0.0192, 100=0.0125, 500=0.00874, 1000=0.00681 (USD); Packaging: Cut Tape (CT); Voltage - Rated: 50V; Mounting Type: Surface Mount, MLCC; Operating Temperature: -55°C ~ 125°C; Applications: Boardflex Sensitive; Ratings: -; Package / Case: 0603 (1608 Metric); Size / Dimension: 0.063" L x 0.031" W (1.60mm x 0.80mm); Height - Seated (Max): -; Thickness (Max): 0.035" (0.90mm); Lead Spacing: -; Features: Soft Termination; Lead Style: -; ComponentLink1URL: http://www.samsungsem.com/kr/front/downloadcms.do?path=/kr/support/product-search/mlcc/__icsFiles/afieldfile/2014/11/05&fileName=S_CL10B104KB8SFNC.pdf; ComponentLink1Description: http://www.samsungsem.com/kr/front/downloadcms.do?path=/kr/support/product-search/mlcc/__icsFiles/afieldfile/2014/11/05&fileName=S_CL10B104KB8SFNC.pdf; Supplier Part Number 1: 1276-1936-1-ND
R11 = 1M 1206 1%: Resistor; Manufacturer: Yageo; Manufacturer Part Number: RV1206FR-071ML; Power (Watts): 0.25W, 1/4W; Temperature Coefficient: ±200ppm/°C; Value: 1M 1206 1%; Supplier 1: Digi-Key; Supplier Part Number 1: 311-1MNICT-ND; RoHS: RoHS Compliant; Category: Resistors; Stock 1: 79790; Pricing 1: 1=0.34, 10=0.289, 25=0.2104, 50=0.1526, 100=0.1131, 250=0.0868, 500=0.06838, 1000=0.04734 (USD); Packaging: Cut Tape (CT); Part Status: Active; Tolerance: ±1%; Composition: Thick Film; Features: High Voltage, Moisture Resistant; Operating Temperature: -55°C ~ 155°C; Package / Case: 1206; Size / Dimension: 0.122" L x 0.063" W (3.10mm x 1.60mm); Height - Seated (Max): 0.026" (0.65mm); Number of Terminations: 2; Failure Rate: -; ComponentLink1URL: http://www.yageo.com/documents/recent/PYu-RV_51_RoHS_L_6.pdf; ComponentLink1Description: Spec Sheet
R20 = Template - Resistor: Manufacturer: Yageo; Manufacturer Part Number: RC0805FR-0749K9L; Value: 49.9k 0603 1%; Tolerance: ±1%; Power (Watts): 0.125W, 1/8W; Temperature Coefficient: ±100ppm/°C; Supplier 1: Digi-Key; Supplier Part Number 1: 311-49.9KCRCT-ND; RoHS: RoHS Compliant; Category: Resistors; Stock 1: 860512; Pricing 1: 1=0.1, 10=0.019, 25=0.0136, 50=0.0104, 100=0.0077, 250=0.00584, 500=0.00468, 1000=0.00345 (USD); Packaging: Cut Tape (CT); Part Status: Active; Composition: Thick Film; Features: Moisture Resistant; Operating Temperature: -55°C ~ 155°C; Package / Case: 0805 (2012 Metric); Size / Dimension: 0.079" L x 0.049" W (2.00mm x 1.25mm); Height - Seated (Max): 0.024" (0.60mm); Number of Terminations: 2; Failure Rate: -; ComponentLink1URL: http://www.yageo.com/NewPortal/yageodocoutput?fileName=/pdf/R-Chip/PYu-RC_Group_51_RoHS_L_4.pdf; ComponentLink1Description: http://www.yageo.com/NewPortal/yageodocoutput?fileName=/pdf/R-Chip/PYu-RC_Group_51_RoHS_L_4.pdf

## Sheet Vsense 0-223.3V.SchDoc: Vsense from 0 to 223.3V
size Letter; Date: 2017-07-12; DocumentNumber: 13; Revision: A; SheetNumber: 13; SheetTotal: 16; DesignedBy: Mike MacKay
Used 3 times, as channels Vsense 0-223, Vsense 0-223, Vsense 0-223. Parts and nets are listed once, with the designators drawn on the sheet.
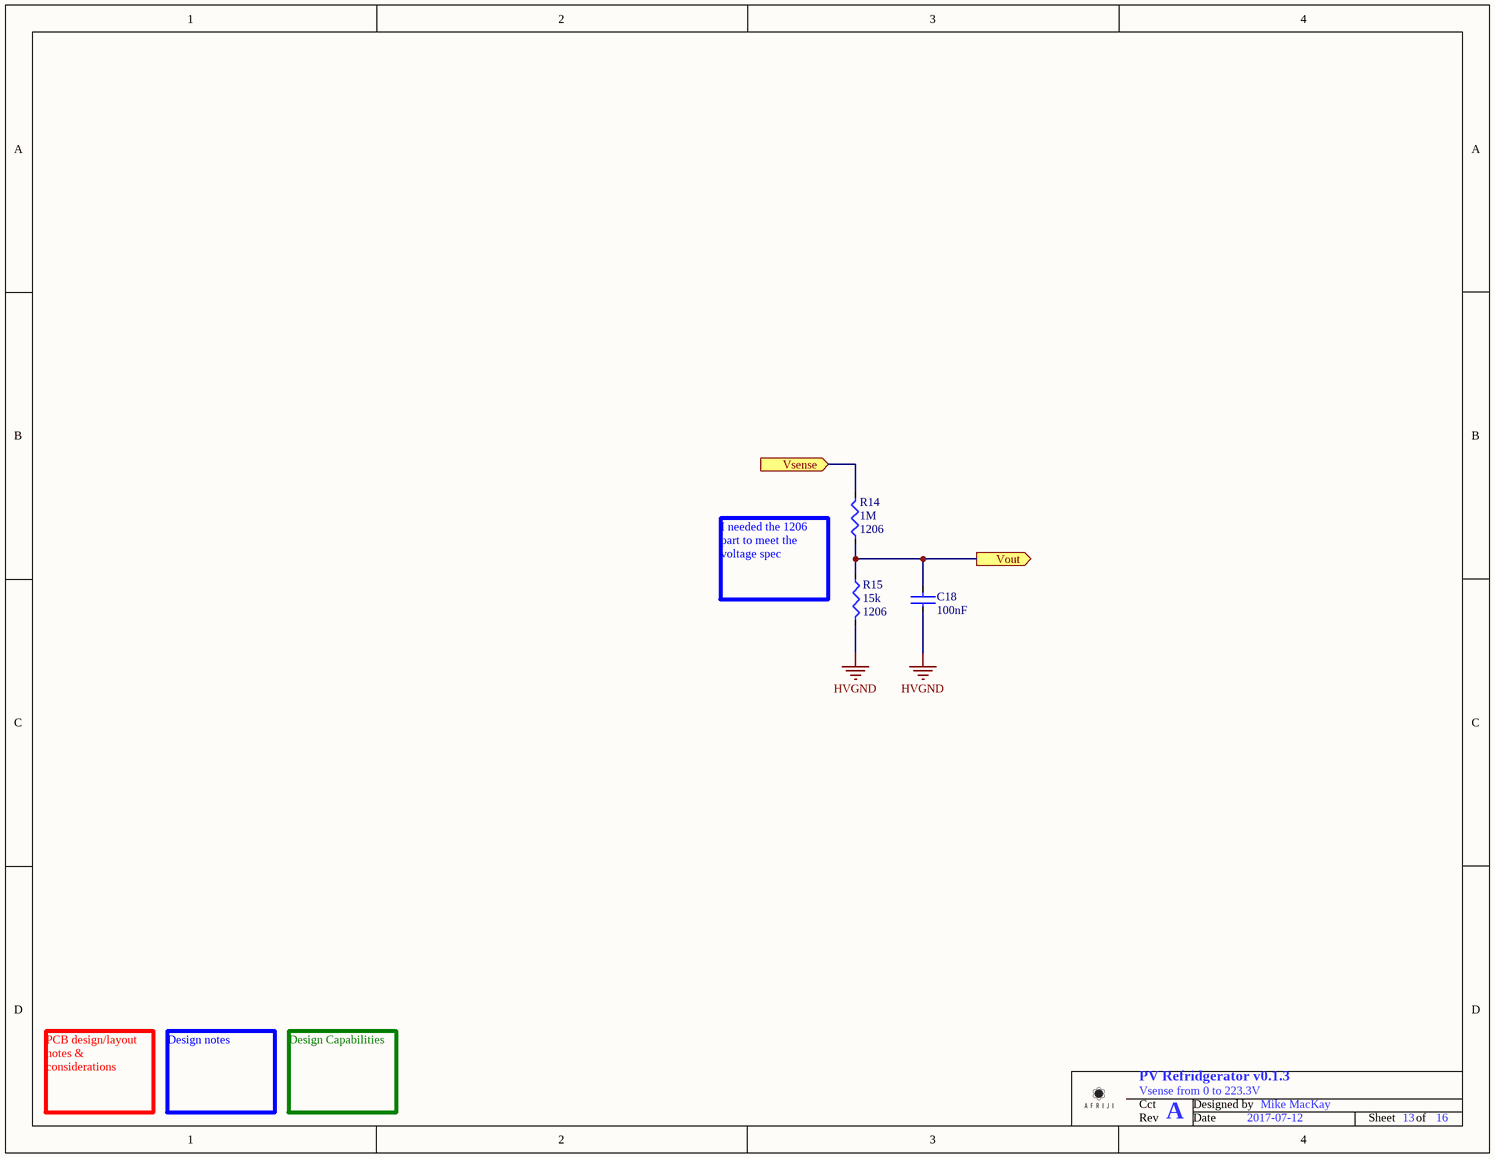
[diagram p14: Vsense 0-223.3V.SchDoc]

### Parts
C18  Capacitance: 100nF  [C0603 - Ceramic]  (hidden comment: 100nF 0603 50V)
R14  Resistance (Ohms): 1M  Supplier Device Package: 1206  [R1210]  (hidden comment: 1M 1206 1%)
R15  Resistance (Ohms): 15k  Supplier Device Package: 1206  [R1210]  (hidden comment: Template - Resistor)

### Ports
Vout (out), Vsense (in)

### Nets
HVGND: C18.2 R15.1
Vout: C18.1 R14.2 R15.2 ; port Vout
Vsense: R14.1 ; port Vsense

### Channels
Vsense 0-223: designators end in A; ports Vout=Vsense (+T1 S) Vsense=+VT1.S
Vsense 0-223: designators end in B; ports Vout=Vsense (+Vout) Vsense=C_VS
Vsense 0-223: designators end in C; ports Vout=Vsense (-Vout) Vsense=D_VS

### Notes on the sheet
- I needed the 1206 part to meet the voltage spec
- PCB design/layout notes & considerations
- Design notes
- Design Capabilities
- Cct
- Designed by
- Rev
- Date
- Sheet
- of

### Library data of the parts
C18 = 100nF 0603 50V: as C5#2 on sheet Microcontroller; Value: 100nF 0603 50V; Supplier 1: Digi-Key; RoHS: RoHS Compliant; Category: Capacitors; Stock 1: 1192070; Pricing 1: 1=0.1, 10=0.027, 25=0.0192, 100=0.0125, 500=0.00874, 1000=0.00681 (USD); Packaging: Cut Tape (CT); Voltage - Rated: 50V; Mounting Type: Surface Mount, MLCC; Operating Temperature: -55°C ~ 125°C; Applications: Boardflex Sensitive; Ratings: -; Package / Case: 0603 (1608 Metric); Size / Dimension: 0.063" L x 0.031" W (1.60mm x 0.80mm); Height - Seated (Max): -; Thickness (Max): 0.035" (0.90mm); Lead Spacing: -; Features: Soft Termination; Lead Style: -; ComponentLink1URL: http://www.samsungsem.com/kr/front/downloadcms.do?path=/kr/support/product-search/mlcc/__icsFiles/afieldfile/2014/11/05&fileName=S_CL10B104KB8SFNC.pdf; ComponentLink1Description: http://www.samsungsem.com/kr/front/downloadcms.do?path=/kr/support/product-search/mlcc/__icsFiles/afieldfile/2014/11/05&fileName=S_CL10B104KB8SFNC.pdf; Supplier Part Number 1: 1276-1936-1-ND
R14 = 1M 1206 1%: as R11 on sheet Vsense 0-69.3V; Value: 1M 1206 1%; Supplier 1: Digi-Key; Supplier Part Number 1: 311-1MNICT-ND; RoHS: RoHS Compliant; Category: Resistors; Stock 1: 79790; Pricing 1: 1=0.34, 10=0.289, 25=0.2104, 50=0.1526, 100=0.1131, 250=0.0868, 500=0.06838, 1000=0.04734 (USD); Packaging: Cut Tape (CT); Part Status: Active; Tolerance: ±1%; Composition: Thick Film; Features: High Voltage, Moisture Resistant; Operating Temperature: -55°C ~ 155°C; Package / Case: 1206; Size / Dimension: 0.122" L x 0.063" W (3.10mm x 1.60mm); Height - Seated (Max): 0.026" (0.65mm); Number of Terminations: 2; Failure Rate: -; ComponentLink1URL: http://www.yageo.com/documents/recent/PYu-RV_51_RoHS_L_6.pdf; ComponentLink1Description: Spec Sheet
R15 = Template - Resistor: Manufacturer: Yageo; Manufacturer Part Number: RC1206FR-0715KL; Value: 15k 1206 1%; Tolerance: ±1%; Power (Watts): 0.25W, 1/4W; Temperature Coefficient: ±100ppm/°C; Supplier 1: Digi-Key; Supplier Part Number 1: 311-15.0KFRCT-ND; RoHS: RoHS Compliant; Category: Resistors; Stock 1: 143517; Pricing 1: 1=0.1, 10=0.029, 25=0.0212, 50=0.016, 100=0.0118, 250=0.009, 500=0.0072, 1000=0.0053 (USD); Packaging: Cut Tape (CT); Part Status: Active; Composition: Thick Film; Features: Moisture Resistant; Operating Temperature: -55°C ~ 155°C; Package / Case: 1206 (3216 Metric); Size / Dimension: 0.122" L x 0.063" W (3.10mm x 1.60mm); Height - Seated (Max): 0.026" (0.65mm); Number of Terminations: 2; Failure Rate: -; ComponentLink1URL: http://www.yageo.com/NewPortal/yageodocoutput?fileName=/pdf/R-Chip/PYu-RC_Group_51_RoHS_L_4.pdf; ComponentLink1Description: http://www.yageo.com/NewPortal/yageodocoutput?fileName=/pdf/R-Chip/PYu-RC_Group_51_RoHS_L_4.pdf

## Sheet Vsense Thermistor.SchDoc: Temperature Sensor (Thermistor)
size Letter; Date: 2017-07-12; DocumentNumber: 14; Revision: B; SheetNumber: 14; SheetTotal: 16; DesignedBy: Mike MacKay
Used 6 times, as channels Vsense Thermistor, Vsense Thermistor, Vsense Thermistor, Vsense Thermistor, Vsense Thermistor, Vsense Thermistor. Parts and nets are listed once, with the designators drawn on the sheet.
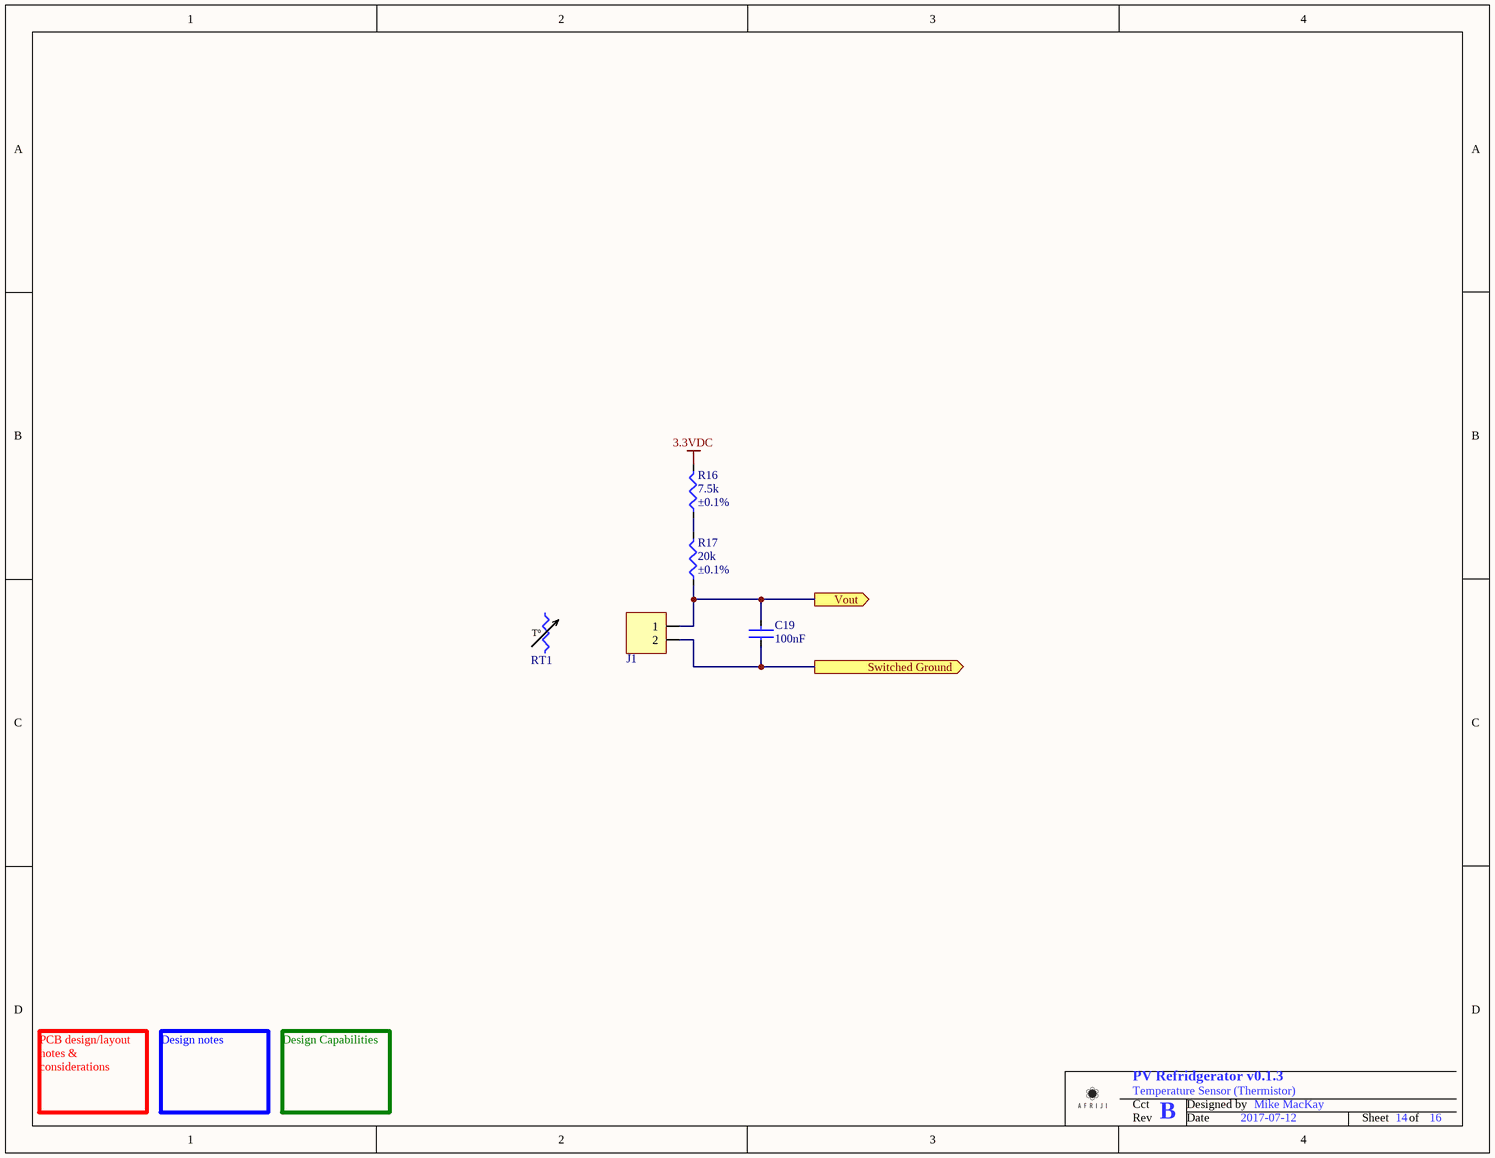
[diagram p15: Vsense Thermistor.SchDoc]

### Parts
C19  Capacitance: 100nF  [C0603 - Ceramic]  (hidden comment: 100nF 0603 50V)
J1  Tº  (value not drawn)
R16  Resistance (Ohms): 7.5k  Tolerance: ±0.1%  [R0603]  (hidden comment: 7.5k 0603 0.1%)
R17  Resistance (Ohms): 20k  Tolerance: ±0.1%  [R0603]  (hidden comment: 20k 0603 0.1%)
RT1  Tº  [Connector - MTA-100 2 Position Friction Lock]  (value not drawn)  (mechanical)

### Ports
Switched Ground (out), Vout (out)

### Nets
3.3VDC: R16.1
Switched Ground: C19.2 J1.2 ; port Switched Ground
Vout: C19.1 J1.1 R17.2 ; port Vout
NetR16_2: R16.2 R17.1

### Channels
Vsense Thermistor: designators end in A; ports Switched Ground=Switched Ground 1 Vout=Vtemp 1
Vsense Thermistor: designators end in B; ports Switched Ground=Switched Ground 2 Vout=Vtemp 2
Vsense Thermistor: designators end in C; ports Switched Ground=Switched Ground 3 Vout=Vtemp 3
Vsense Thermistor: designators end in D; ports Switched Ground=Switched Ground 4 Vout=Vtemp 4
Vsense Thermistor: designators end in E; ports Switched Ground=Switched Ground 5 Vout=Vtemp 5
Vsense Thermistor: designators end in F; ports Switched Ground=Switched Ground 6 Vout=Vtemp 6

### Notes on the sheet
- PCB design/layout notes & considerations
- Design notes
- Design Capabilities
- Cct
- Designed by
- Rev
- Date
- Sheet
- of

### Library data of the parts
C19 = 100nF 0603 50V: as C5#2 on sheet Microcontroller; Value: 100nF 0603 50V; Supplier 1: Digi-Key; RoHS: RoHS Compliant; Category: Capacitors; Stock 1: 1192070; Pricing 1: 1=0.1, 10=0.027, 25=0.0192, 100=0.0125, 500=0.00874, 1000=0.00681 (USD); Packaging: Cut Tape (CT); Voltage - Rated: 50V; Mounting Type: Surface Mount, MLCC; Operating Temperature: -55°C ~ 125°C; Applications: Boardflex Sensitive; Ratings: -; Package / Case: 0603 (1608 Metric); Size / Dimension: 0.063" L x 0.031" W (1.60mm x 0.80mm); Height - Seated (Max): -; Thickness (Max): 0.035" (0.90mm); Lead Spacing: -; Features: Soft Termination; Lead Style: -; ComponentLink1URL: http://www.samsungsem.com/kr/front/downloadcms.do?path=/kr/support/product-search/mlcc/__icsFiles/afieldfile/2014/11/05&fileName=S_CL10B104KB8SFNC.pdf; ComponentLink1Description: http://www.samsungsem.com/kr/front/downloadcms.do?path=/kr/support/product-search/mlcc/__icsFiles/afieldfile/2014/11/05&fileName=S_CL10B104KB8SFNC.pdf; Supplier Part Number 1: 1276-1936-1-ND
J1 = MTA100-2 with friction Lock: as TP3 on sheet Microcontroller; Value: MTA100-2 with friction Lock; Supplier 1: Digi-Key; Supplier Part Number 1: A1921-ND; RoHS: RoHS Compliant; Category: Connectors, Interconnects; Stock 1: 177276; Pricing 1: 1=0.12, 10=0.117, 50=0.0748, 100=0.0724, 250=0.0624, 500=0.05992, 1000=0.05243, 2500=0.04744 (USD); Packaging: Bulk; Part Status: Active; Operating Temperature: -55°C ~ 105°C; Mounting Type: Through Hole; ComponentLink1URL: http://www.te.com/commerce/DocumentDelivery/DDEController?Action=srchrtrv&DocNm=640456&DocType=Customer+Drawing&DocLang=English; ComponentLink1Description: Spec Sheet; Contact Type: Male Pin; Number of Rows: 1; Row Spacing - Mating: -; Termination: Solder; Fastening Type: Friction Lock; Insulation Height: 0.305" (7.75mm); Contact Shape: Square; Contact Finish - Mating: Tin; Contact Finish Thickness - Mating: -; Contact Finish - Post: Tin; Contact Material: Copper Alloy; Insulation Material: Thermoplastic; Features: -; Ingress Protection: -; Insulation Color: Natural; Mated Stacking Heights: -; Contact Finish Thickness - Post: -; Applications: General Purpose
R16 = 7.5k 0603 0.1%: Resistor; Manufacturer: Yageo; Manufacturer Part Number: RT0603BRD077K5L; Power (Watts): 0.1W, 1/10W; Temperature Coefficient: ±25ppm/°C; Technology: SMT; Value: 7.5k 0603 0.1%; Supplier 1: Digi-Key; Supplier Part Number 1: YAG2311CT-ND; RoHS: RoHS Compliant; Category: Resistors; Stock 1: 15357; Pricing 1: 1=0.32, 10=0.269, 25=0.1952, 50=0.1416, 100=0.105, 250=0.0806, 500=0.0635, 1000=0.04396 (USD); Packaging: Cut Tape (CT); Part Status: Active; Composition: Thin Film; Features: Moisture Resistant; Operating Temperature: -55°C ~ 155°C; Package / Case: 0603 (1608 Metric); Supplier Device Package: 0603; Size / Dimension: 0.063" L x 0.031" W (1.60mm x 0.80mm); Height - Seated (Max): 0.022" (0.55mm); Number of Terminations: 2; Failure Rate: -; ComponentLink1URL: http://www.yageo.com/documents/recent/PYu-RT_1-to-0.05_RoHS_L_7.pdf; ComponentLink1Description: Spec Sheet
R17 = 20k 0603 0.1%: Resistor; Manufacturer: Yageo; Manufacturer Part Number: RT0603BRD0720KL; Power (Watts): 0.1W, 1/10W; Temperature Coefficient: ±25ppm/°C; Technology: SMT; Value: 20k 0603 0.1%; Supplier 1: Digi-Key; Supplier Part Number 1: YAG1582CT-ND; RoHS: RoHS Compliant; Category: Resistors; Stock 1: 24543; Pricing 1: 1=0.35, 10=0.297, 25=0.216, 50=0.1566, 100=0.1161, 250=0.08912, 500=0.0702, 1000=0.0486 (USD); Packaging: Cut Tape (CT); Part Status: Active; Composition: Thin Film; Features: Moisture Resistant; Operating Temperature: -55°C ~ 155°C; Package / Case: 0603 (1608 Metric); Supplier Device Package: 0603; Size / Dimension: 0.063" L x 0.031" W (1.60mm x 0.80mm); Height - Seated (Max): 0.022" (0.55mm); Number of Terminations: 2; Failure Rate: -; ComponentLink1URL: http://www.yageo.com/documents/recent/PYu-RT_1-to-0.05_RoHS_L_7.pdf; ComponentLink1Description: Spec Sheet
RT1 = Thermistor 10k Type J: Resistor; Manufacturer: Murata Electronics North America; Manufacturer Part Number: NXFT15XH103FA2B025; Resistance in Ohms @ 25°C: 10k; Resistance Tolerance: ±1%; B25/50: 3380K; B25/85: 3434K; B25/100: 3455K; Power - Max: 100mW; Value: Thermistor 10k; Supplier 1: Digi-Key; RoHS: RoHS Compliant; Category: Sensors, Transducers; Stock 1: 21226; Pricing 1: 1=0.91, 10=0.752, 25=0.6608, 50=0.549, 100=0.4676, 250=0.42692, 500=0.4066, 1000=0.35578, 2500=0.34053 (USD); Packaging: Bulk; Part Status: Active; Mounting Type: Free Hanging; Operating Temperature: -40°C ~ 125°C; ComponentLink1URL: http://www.murata.com/~/media/webrenewal/support/library/catalog/products/thermistor/ntc/r44e.ashx; ComponentLink1Description: Spec Sheet; Supplier Part Number 1: 490-5628-ND; Technology: THT; B Value Tolerance: ±1%; B0/50: -; B25/75: -; Length - Lead Wire: -; Package / Case: Bead